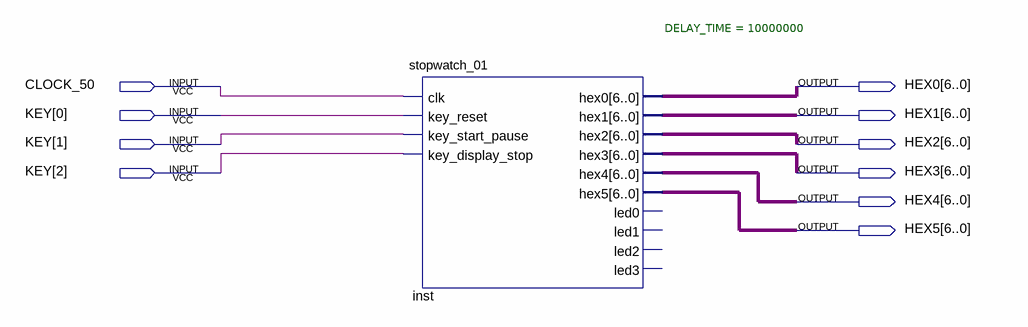
[diagram p0: schematic sheet]
// Quartus schematic Multifunctional_Stopwatch.bdf as structural Verilog: 1 symbols, 10 pins
module Multifunctional_Stopwatch (
  input  CLOCK_50,
  input  [2:0] KEY,
  output [6:0] HEX0,
  output [6:0] HEX1,
  output [6:0] HEX2,
  output [6:0] HEX3,
  output [6:0] HEX4,
  output [6:0] HEX5
);

  stopwatch_01 #(.DELAY_TIME(10000000)) inst (
    .clk(CLOCK_50), .key_reset(KEY[0]), .key_start_pause(KEY[1]), .key_display_stop(KEY[2]), .hex0(HEX0),
    .hex1(HEX1), .hex2(HEX2), .hex3(HEX3), .hex4(HEX4), .hex5(HEX5));  // open: led0, led1, led2, led3
endmodule
